# Altium project Expand_Nucleo.PrjPcb
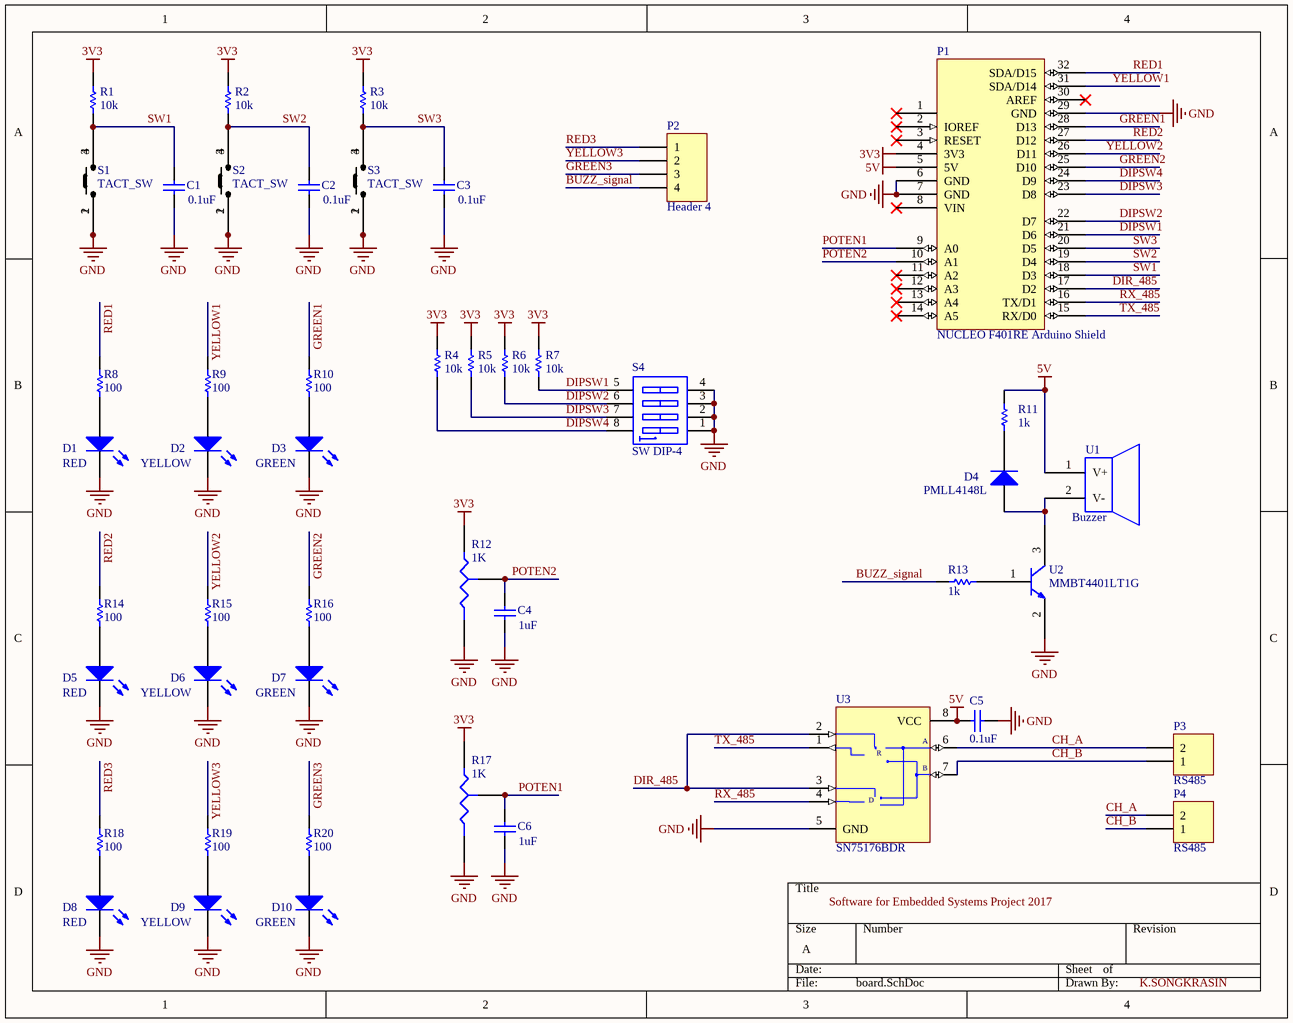
[diagram p0: board.SchDoc]
1 sheet, 47 parts. Net scope: global (net labels, ports and power ports of the same name join across sheets).
Board files: board.PcbDoc, Combine.PcbDoc

## Sheet board.SchDoc
size A

### Parts
C1  0.1uF  [CAP0603]
C2  0.1uF  [CAP0603]
C3  0.1uF  [CAP0603]
C4  1uF  [CAP0603]
C5  0.1uF  [CAP0603]
C6  1uF  [CAP0603]
D1  RED  [LED_RED_3MM]
D2  YELLOW  [LED_YELLOW_3MM]
D3  GREEN  [LED_GREEN_3MM]
D4  PMLL4148L  [SOD_08]
D5  RED  [LED_RED_3MM]
D6  YELLOW  [LED_YELLOW_3MM]
D7  GREEN  [LED_GREEN_3MM]
D8  RED  [LED_RED_3MM]
D9  YELLOW  [LED_YELLOW_3MM]
D10  GREEN  [LED_GREEN_3MM]
P1  NUCLEO F401RE Arduino Shield  [NECLEO_F401RE_SHIELD]
P2  Header 4  [PIN_STRAIGHT_1X4]
P3  RS485  [5EHDRC_1X2]
P4  RS485  [5EHDRC_1X2]
R1  10k  [RES0603]
R2  10k  [RES0603]
R3  10k  [RES0603]
R4  10k  [RES0603]
R5  10k  [RES0603]
R6  10k  [RES0603]
R7  10k  [RES0603]
R8  100  [RES_VERTICAL_1/4W]
R9  100  [RES_VERTICAL_1/4W]
R10  100  [RES_VERTICAL_1/4W]
R11  1k  [RES0603]
R12  1K  [POTEN_3362P]
R13  1k  [RES0603]
R14  100  [RES_VERTICAL_1/4W]
R15  100  [RES_VERTICAL_1/4W]
R16  100  [RES_VERTICAL_1/4W]
R17  1K  [POTEN_3362P]
R18  100  [RES_VERTICAL_1/4W]
R19  100  [RES_VERTICAL_1/4W]
R20  100  [RES_VERTICAL_1/4W]
S1  TACT_SW  [TACT_SW_6X6]
S2  TACT_SW  [TACT_SW_6X6]
S3  TACT_SW  [TACT_SW_6X6]
S4  SW DIP-4  [DIP_SW_4]
U1  Buzzer  [MAGNETIC_BUZZER]
U2  MMBT4401LT1G  [SOT-23A]
U3  SN75176BDR  [SOIC8]

### Nets
3V3: P1.4(3V3) R1.1 R2.1 R3.1 R4.1 R5.1 R6.1 R7.1 R12.1(A) R17.1(A)
5V: C5.2 P1.5(5V) R11.2 U1.1(V+) U3.8(VCC)
GND: C1.1 C2.1 C3.1 C4.1 C5.1 C6.1 D1.2(K) D2.2(K) D3.2(K) D5.2(K) D6.2(K) D7.2(K) D8.2(K) D9.2(K) D10.2(K) P1.6(GND) P1.7(GND) P1.29(GND) R12.2(B) R17.2(B) S1.1 S1.2 S2.1 S2.2 S3.1 S3.2 S4.1(A1) S4.2(A2) S4.3(A3) S4.4(A4) U2.2 U3.5(GND)
BUZZ_signal: P2.4 R13.2
CH_A: P3.2 P4.2 U3.6(A)
CH_B: P3.1 P4.1 U3.7(B)
DIPSW1: P1.21(D6) R7.2 S4.5(B4)
DIPSW2: P1.22(D7) R6.2 S4.6(B3)
DIPSW3: P1.23(D8) R5.2 S4.7(B2)
DIPSW4: P1.24(D9) R4.2 S4.8(B1)
DIR_485: P1.17(D2) U3.2(~{RE}) U3.3(DE)
GREEN1: P1.28(D13) R10.2
GREEN2: P1.25(D10) R16.2
GREEN3: P2.3 R20.2
POTEN1: C6.2 P1.9(A0) R17.3(TAP)
POTEN2: C4.2 P1.10(A1) R12.3(TAP)
RED1: P1.32(SDA/D15) R8.2
RED2: P1.27(D12) R14.2
RED3: P2.1 R18.2
RX_485: P1.16(TX/D1) U3.4(DI)
SW1: C1.2 P1.18(D3) R1.2 S1.3 S1.4
SW2: C2.2 P1.19(D4) R2.2 S2.3 S2.4
SW3: C3.2 P1.20(D5) R3.2 S3.3 S3.4
TX_485: P1.15(RX/D0) U3.1(RO)
YELLOW1: P1.31(SDA/D14) R9.2
YELLOW2: P1.26(D11) R15.2
YELLOW3: P2.2 R19.2
NetD1_1: D1.1(A) R8.1
NetD2_1: D2.1(A) R9.1
NetD3_1: D3.1(A) R10.1
NetD4_1: D4.1(A) U1.2(V-) U2.3
NetD4_2: D4.2(K) R11.1
NetD5_1: D5.1(A) R14.1
NetD6_1: D6.1(A) R15.1
NetD7_1: D7.1(A) R16.1
NetD8_1: D8.1(A) R18.1
NetD9_1: D9.1(A) R19.1
NetD10_1: D10.1(A) R20.1
NetR13_1: R13.1 U2.1

Not connected (* = marked no-connect by the designer): P1 1* 2(IOREF)* 3(RESET)* 8(VIN)* 11(A2)* 12(A3)* 13(A4)* 14(A5)* 30(AREF)*

### Notes on the sheet
- Labels drawn without touching a wire or pin: K.SONGKRASIN, Software for Embedded Systems Project 2017
- (in symbol MAX485CSA) R; D

### Library data of the parts
C1-C3 C5 = Cap: Capacitor; Price: 0.45; Link: http://www.es.co.th/detail.asp?Prod=009202006
C4 C6 = Cap: Chip Monolithic Ceramic Cap 1uF/50Vdc, ±10%, X5R; Price: 0.98; Link: http://www.es.co.th/detail.asp?Prod=016001561
D1 D5 D8 = LED3: Typical BLUE LED Round 3mm
D2 D3 D6 D7 D9 D10 = LED3: Typical GREEN LED Round 3mm
D4 = Diode: HIGH-SPEED SWITCHING DIODES 75V/200MA; Link: http://www.es.co.th/detail.asp?Prod=001602013; Price: 0.38
P1 = NUCLEO_F401RE_ARDUINO_SHEILD: NUCLEO F401RE Arduino UNO shield
P2 = Header 4: Pin Header Connector 4 Pins,2.54mm Pitch; LatestRevisionDate: 17-Jul-2002; LatestRevisionNote: Re-released for DXP Platform.; Publisher: Altium Limited
P3 P4 = Header 2: Header, 2-Pin; Current rating: 15A; Rate Voltage: 300V; Link (Socket): http://www.es.co.th/detail.asp?Prod=00500109; Price(Socket): 2.98; Link(Plug): http://www.es.co.th/detail.asp?PROD=00500232; Price(Plug): 7.74
R1-R10 R14-R16 R18-R20 = Res1: Thick Film Chip Resistors 10KO ±1%,1/10W
  R1-R7: Link: http://www.es.co.th/detail.asp?Prod=015022767; Price: 0.09
R11 R13 = Res1: Thick Film Chip Resistors 1KO ±1%,1/10W; Link: http://www.es.co.th/detail.asp?Prod=015024543; Price: 0.09
R12 R17 = Res Tap: Trimpot 1 Turns, 1kO,±10%, 0.5 w.; Link: http://www.es.co.th/detail.asp?Prod=014102313; Price: 7.71
S1-S3 = TACT_SW: Tact Switch 6x6mm, 4 Pins SMD; Link: http://www.es.co.th/detail.asp?Prod=017101396; Price: 1.83
S4 = SW DIP-4: DIP Switch, 4 Position, SPST; Link: http://www.es.co.th/detail.asp?Prod=006800202; Price: 14.91
U2 = NPN: Switching Transistor NPN 40V/0.6A; Link: http://www.es.co.th/detail.asp?Prod=023502490; Price: 0.49
U3 = MAX485CSA: Low-Power, Slew-Rate-Limited RS-485/RS-422 Transceiver; Link (es): http://www.es.co.th/detail.asp?Prod=08602746; Price: 7.07
U1 = Buzzer: Link: http://www.es.co.th/detail.asp?Prod=023700072; Price: 4.52